# EAGLE design audio2 (EAGLE 6.4)
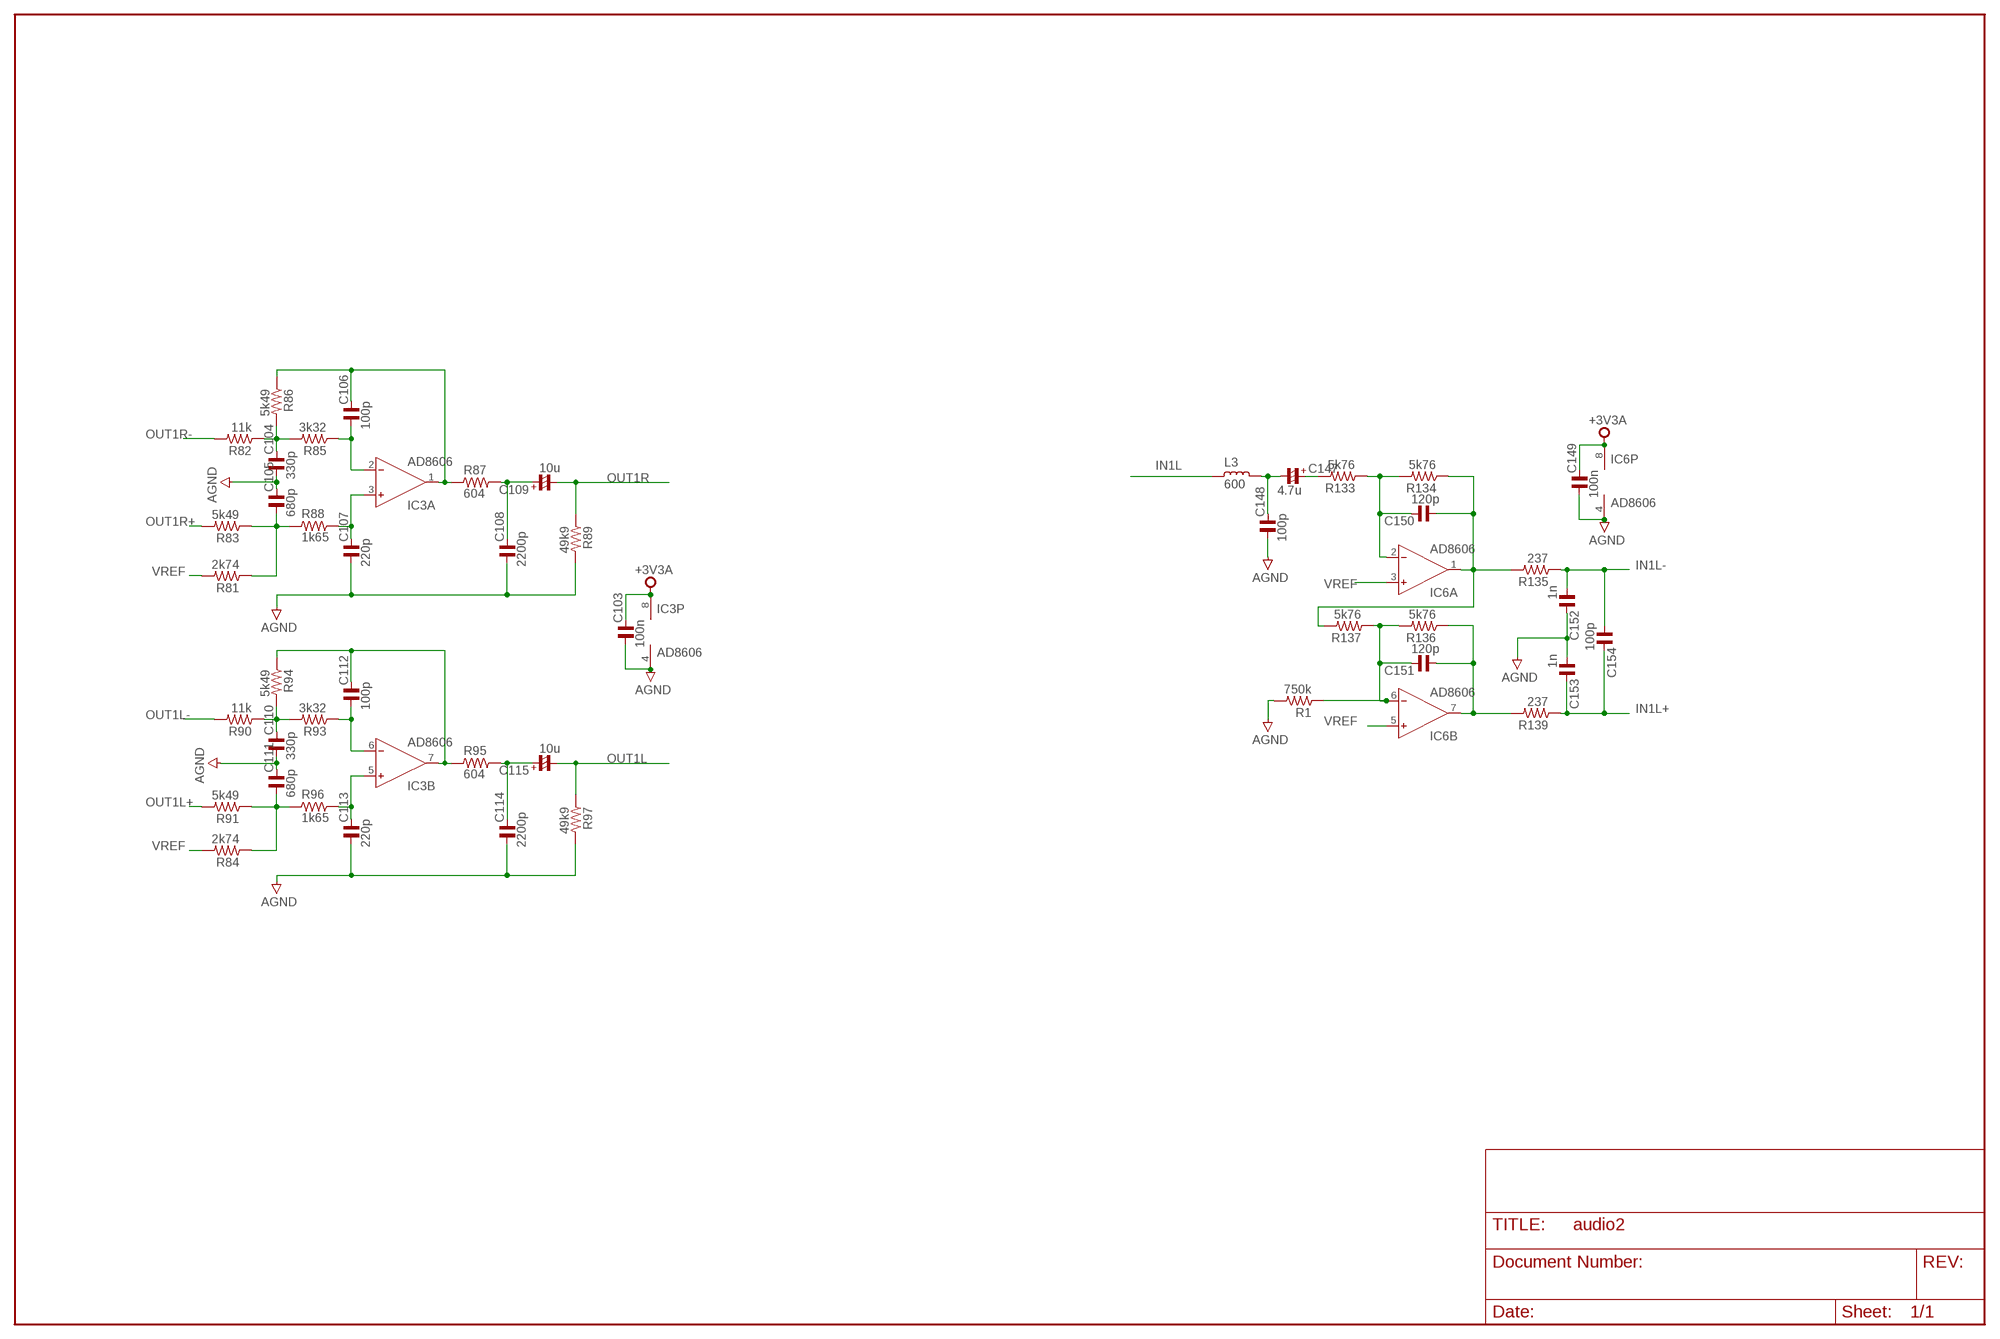
[diagram p0: schematic, sheet 1]

## Parts
C103  100n  C_0603  [C0603]
C104  330p  C_0603  [C0603]
C105  680p  C_0603  [C0603]
C106  100p  C_0603  [C0603]
C107  220p  C_0603  [C0603]
C108  2200p  C_0603  [C0603]
C109  10u  CP_1206/T  [C1206/T]
C110  330p  C_0603  [C0603]
C111  680p  C_0603  [C0603]
C112  100p  C_0603  [C0603]
C113  220p  C_0603  [C0603]
C114  2200p  C_0603  [C0603]
C115  10u  CP_1206/T  [C1206/T]
C147  4.7u  CP_1206/T  [C1206/T]
C148  100p  C_0603  [C0603]
C149  100n  C_0603  [C0603]
C150  120p  C_0603  [C0603]
C151  120p  C_0603  [C0603]
C152  1n  C_0603  [C0603]
C153  1n  C_0603  [C0603]
C154  100p  C_0603  [C0603]
IC3  AD8606  AD8607R  [SO8]
IC6  AD8606  AD8607R  [SO8]
L3  600  L_1206  [L1206]
R1  750k  R_0603  [R0603]
R81  2k74  R_0603  [R0603]
R82  11k  R_0603  [R0603]
R83  5k49  R_0603  [R0603]
R84  2k74  R_0603  [R0603]
R85  3k32  R_0603  [R0603]
R86  5k49  R_0603  [R0603]
R87  604  R_0603  [R0603]
R88  1k65  R_0603  [R0603]
R89  49k9  R_0603  [R0603]
R90  11k  R_0603  [R0603]
R91  5k49  R_0603  [R0603]
R93  3k32  R_0603  [R0603]
R94  5k49  R_0603  [R0603]
R95  604  R_0603  [R0603]
R96  1k65  R_0603  [R0603]
R97  49k9  R_0603  [R0603]
R133  5k76  R_0603  [R0603]
R134  5k76  R_0603  [R0603]
R135  237  R_0603  [R0603]
R136  5k76  R_0603  [R0603]
R137  5k76  R_0603  [R0603]
R139  237  R_0603  [R0603]

## Nets
+3V3A: C103.2 C149.2 IC3.8(P:V+) IC6.8(P:V+)
AGND: C103.1 C104.1 C105.2 C107.1 C108.1 C110.1 C111.2 C113.1 C114.1 C148.1 C149.1 C152.2 C153.1 IC3.4(P:V-) IC6.4(P:V-) R1.2 R89.2 R97.2
IN1L: L3.2
IN1L+: C153.2 C154.2 R139.1
IN1L-: C152.1 C154.1 R135.1
N$1: C147.+ R133.2
N$68: C104.2 R82.1 R85.2 R86.2
N$69: C105.1 R81.1 R83.1 R88.1
N$70: C107.2 IC3.3(A:IN+) R88.2
N$71: C106.2 IC3.1(A:OUT) R86.1 R87.1
N$72: C108.2 C109.+ R87.2
N$73: C110.2 R90.1 R93.2 R94.2
N$74: C106.1 IC3.2(A:IN-) R85.1
N$75: C111.1 R84.1 R91.1 R96.1
N$76: C113.2 IC3.5(B:IN+) R96.2
N$77: C112.2 IC3.7(B:OUT) R94.1 R95.1
N$78: C114.2 C115.+ R95.2
N$79: C112.1 IC3.6(B:IN-) R93.1
N$104: C150.1 IC6.1(A:OUT) R134.1 R135.2 R137.2
N$105: C151.1 IC6.7(B:OUT) R136.1 R139.2
N$106: C147.- C148.2 L3.1
N$108: C150.2 IC6.2(A:IN-) R133.1 R134.2
N$110: C151.2 IC6.6(B:IN-) R1.1 R136.2 R137.1
OUT1L: C115.- R97.1
OUT1L+: R91.2
OUT1L-: R90.2
OUT1R: C109.- R89.1
OUT1R+: R83.2
OUT1R-: R82.2
VREF: IC6.3(A:IN+) IC6.5(B:IN+) R81.2 R84.2

## Library data of the parts
C103-C108 C110-C114 C148-C154 = rc-master-smd:C_: NON-POLARIZED CAP
C109 C115 C147 = rc-master-smd:CP_: POLARIZED CAP
IC3 IC6 = analog-devices:AD8607: Precision Micropower, Low Noise CMOS, Rail-to-Rail Input/Output Operational Amplifiers Source: http://www.analog.com/static/imported-files/data_sheets/AD8603_8607_8609.pdf; MPN: AD8607ARMZ-R2; OC_FARNELL: 1651293; OC_NEWARK: 19M8927
L3 = rc-master-smd:L_: INDUCTOR
R1 R81-R91 R93-R97 R133-R137 R139 = rc-master-smd:R_: RESISTOR

## Board
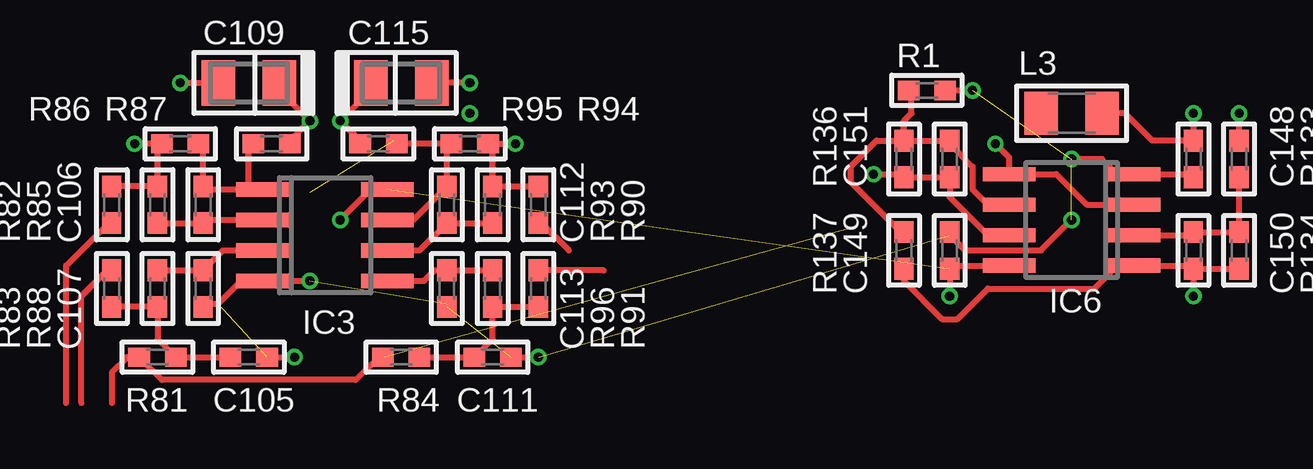
[diagram p1: board, top side]
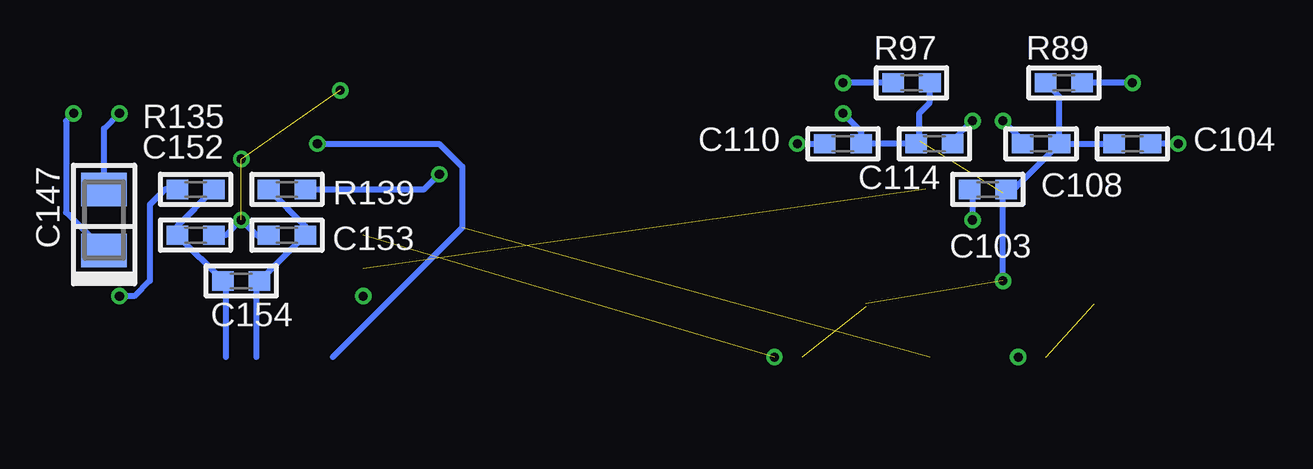
[diagram p2: board, bottom side, seen from below]

No outline drawn. Coordinates in mm, seen from the top.
Copper layers (1*2+3*16): Top 0.035mm / dielectric 1.5mm / Route2 0.035mm / dielectric 0.15mm / Route3 0.035mm / dielectric 0.2mm / Bottom 0.035mm
Design rules "default *": minimum track width 6mil, minimum drill 15mil, track to track 6mil, track to pad 6mil, pad to pad 6mil, via to via 6mil, smd to smd 6mil, copper to edge 10mil, drill to drill 8mil, minimum pad ring 6mil, minimum via ring 6mil, stop-mask expansion 4mil, vias tented up to drill 0mil, thermal gap 10mil

### Footprints (pad centres in the part's own frame; a part is rotated, then mirrored left to right if it is on the bottom)
C0603 = smd 0.9 x 0.8: 1 -0.762,0; 2 0.762,0
C1206/T = smd 1.4 x 1.9: + 1.27,0; - -1.27,0
SO8 = smd 0.6 x 2.2: 1 -1.905,-2.6; 2 -0.635,-2.6; 3 0.635,-2.6; 4 1.905,-2.6; 5 1.905,2.6; 6 0.635,2.6; 7 -0.635,2.6; 8 -1.905,2.6
L1206 = smd 1.4 x 1.8: 1 -1.27,0; 2 1.27,0
R0603 = smd 0.9 x 0.8: 1 -0.762,0; 2 0.762,0

### Placement (x,y rotation side)
C103  34.29,80.64 180 bottom
C104  28.26,82.55 0 bottom
C105  31.11,73.66 0 top
C106  29.21,80.01 90 top
C107  29.21,76.52 90 top
C108  32.07,82.55 180 bottom
C109  31.11,85.09 0 top
C110  40.32,82.55 180 bottom
C111  41.27,73.66 0 top
C112  39.37,80.01 90 top
C113  39.37,76.52 90 top
C114  36.51,82.55 0 bottom
C115  37.47,85.09 180 top
C147  71.12,79.38 270 bottom
C148  70.48,81.92 90 top
C149  60.33,78.11 270 top
C150  70.48,78.11 90 top
C151  60.33,81.92 90 top
C152  67.31,78.74 0 bottom
C153  63.5,78.74 0 bottom
C154  65.41,76.83 0 bottom
IC3  34.29,78.74 270 top
IC6  65.41,79.38 90 top
L3  65.41,83.82 180 top
R1  59.37,84.77 0 top
R81  27.3,73.66 180 top
R82  25.4,80.01 270 top
R83  25.4,76.52 90 top
R84  37.47,73.66 180 top
R85  27.3,80.01 90 top
R86  28.26,82.55 180 top
R87  32.07,82.55 0 top
R88  27.3,76.52 90 top
R89  31.11,85.09 180 bottom
R90  43.18,80.01 270 top
R91  43.18,76.52 90 top
R93  41.27,80.01 90 top
R94  40.32,82.55 0 top
R95  36.51,82.55 180 top
R96  41.27,76.52 90 top
R97  37.47,85.09 0 bottom
R133  72.39,81.92 90 top
R134  72.39,78.11 90 top
R135  67.31,80.64 180 bottom
R136  58.42,81.92 90 top
R137  58.42,78.11 270 top
R139  63.5,80.64 0 bottom

### Tracks (layer width: path | path; a pad name or v marks a point on that pad's centre or on a via)
+3V3A  (via drill 0.38)  (1 unrouted)
  Top 0.254: IC3.8 36.2,80.64 v34.92,79.38 | IC6.8 60.45,77.47 C149.2 v60.33,76.2
  Bottom 0.254: v34.92,79.38 34.92,80.52 C103.2
AGND  (via drill 0.38)  (7 unrouted)
  Top 0.254: 29.02,75.56 C107.1 29.34,75.88 29.84,75.88 30.8,76.83 IC3.4 v33.66,76.83 | C113.1 39.37,75.88 | C105.2 v33.02,73.66 | C111.2 v43.18,73.66 | C148.1 70.36,81.28 IC6.4 67.31,81.28 66.67,81.92 v65.41,81.92 | C149.1 60.33,78.74 60.96,78.11 64.14,78.11 v65.41,79.38 | R1.2 v61.28,84.77
  Bottom 0.254: C108.1 31.3,84.52 R89.2 | C108.1 33.21,80.64 C103.1 33.66,80.52 v33.66,76.83 | R97.2 36.7,84.26 37.15,83.82 37.15,82.68 C114.1 C110.1 39.56,83.06 v40.32,83.82 | C152.2 66.04,78.74 v65.41,79.38 64.77,78.74 C153.1 | C108.1 C104.1
IN1L+
  Bottom 0.254: R139.1 62.74,79.12 C153.2 C154.2 64.77,76.83 64.77,73.66
IN1L-
  Bottom 0.254: R135.1 68.07,79.12 C152.1 C154.1 66.04,76.83 66.04,73.66
N$1  (via drill 0.38)
  Top 0.254: R133.2 v72.39,83.82
  Bottom 0.254: v72.39,83.82 72.71,83.5 72.71,79.69 C147.+
N$68  (via drill 0.38)
  Top 0.254: v26.35,82.55 C104.2 27.3,82.36 R85.2 R82.1
  Bottom 0.254: v26.35,82.55 C104.2
N$69
  Top 0.254: R83.1 R88.1 27.3,74.42 R81.1 C105.1
N$70
  Top 0.254: IC3.3 30.04,78.11 C107.2 R88.2
N$71
  Top 0.254: R86.1 29.21,82.36 C106.2 29.34,80.64 31.11,80.64 | 31.11,80.64 IC3.1 | 31.11,80.64 31.11,82.36 R87.1
N$72  (via drill 0.38)
  Top 0.254: C109.+ 32.83,84.64 32.83,84.33 v33.66,83.5 33.02,82.87 C108.2
  Bottom 0.254: C108.2 33.02,82.87 v33.66,83.5
N$73  (via drill 0.38)
  Top 0.254: R90.1 R93.2 41.27,82.36 C110.2 v42.23,82.55
  Bottom 0.254: v42.23,82.55 C110.2
N$74
  Top 0.254: R85.1 C106.1 29.34,79.38 IC3.2
N$75
  Top 0.254: R91.1 R96.1 41.27,74.42 C111.1 R84.1
N$76
  Top 0.254: IC3.5 38.42,76.83 38.86,77.28 C113.2 R96.2
N$77
  Top 0.254: IC3.7 37.97,79.38 C112.2 39.37,82.36 R94.1 R95.1
N$78  (via drill 0.38)
  Top 0.254: v34.92,83.5 35.88,84.45 35.88,84.77 C115.+ | v34.92,83.5 35.75,82.68 C114.2 35.88,82.55 v34.92,83.5
  Bottom 0.254: C114.2 35.88,82.55 v34.92,83.5
N$79
  Top 0.254: IC3.6 38.23,78.11 C112.1 R93.1
N$104  (via drill 0.38)
  Top 0.254: C150.1 70.36,77.47 IC6.1 67.31,77.47 66.36,76.52 61.91,76.52 60.64,75.25 60.01,75.25 58.42,76.83 R137.2 | C150.1 R134.1 | C150.1 v70.48,76.2
  Bottom 0.254: R135.2 68.58,80.64 69.22,80.01 69.22,76.83 69.85,76.2 v70.48,76.2
N$105  (via drill 0.38)
  Top 0.254: IC6.7 61.91,78.74 60.33,80.33 C151.1 R136.1 | 58.29,81.15 R136.1 | v57.15,81.28 58.29,81.28 R136.1
  Bottom 0.254: R139.2 57.78,80.64 v57.15,81.28
N$106  (via drill 0.38)
  Top 0.254: L3.1 67.63,83.82 68.77,82.68 C148.2 v70.48,83.82
  Bottom 0.254: C147.- 71.12,83.19 v70.48,83.82
N$108
  Top 0.254: R133.1 R134.2 C150.2 70.36,78.74 IC6.2
N$110
  Top 0.254: IC6.6 61.91,80.01 61.28,80.64 61.28,81.6 60.33,82.55 C151.2 R136.2 | R137.1 58.29,78.87 56.2,80.96 56.2,81.6 57.28,82.68 R136.2 | R136.2 58.42,83.5 58.74,83.82 58.74,84.64 R1.1
OUT1L  (via drill 0.38)
  Top 0.254: v40.32,85.09 C115.-
  Bottom 0.254: R97.1 v40.32,85.09
OUT1L+
  Top 0.254: 45.91,77.28 R91.2
OUT1L-
  Top 0.254: 44.45,78.11 43.31,79.25 R90.2
OUT1R  (via drill 0.38)
  Top 0.254: v28.26,85.09 C109.-
  Bottom 0.254: v28.26,85.09 R89.1
OUT1R+
  Top 0.254: 24.13,71.75 24.13,76.2 25.21,77.28 R83.2
OUT1R-
  Top 0.254: 23.5,71.75 23.5,77.47 25.27,79.25 R82.2
VREF  (via drill 0.38)  (1 unrouted)
  Top 0.254: IC6.3 66.04,80.01 64.77,81.28 IC6.5 62.8,81.97 v62.23,82.55 | 25.4,71.75 25.4,73.03 26.04,73.66 R81.2 27.5,72.71 35.56,72.71 36.51,73.66 R84.2
  Bottom 0.254: v62.23,82.55 57.15,82.55 56.2,81.6 56.2,79.06 61.59,73.66